# EAGLE schematic uStar_v1 (EAGLE 7.5.0)
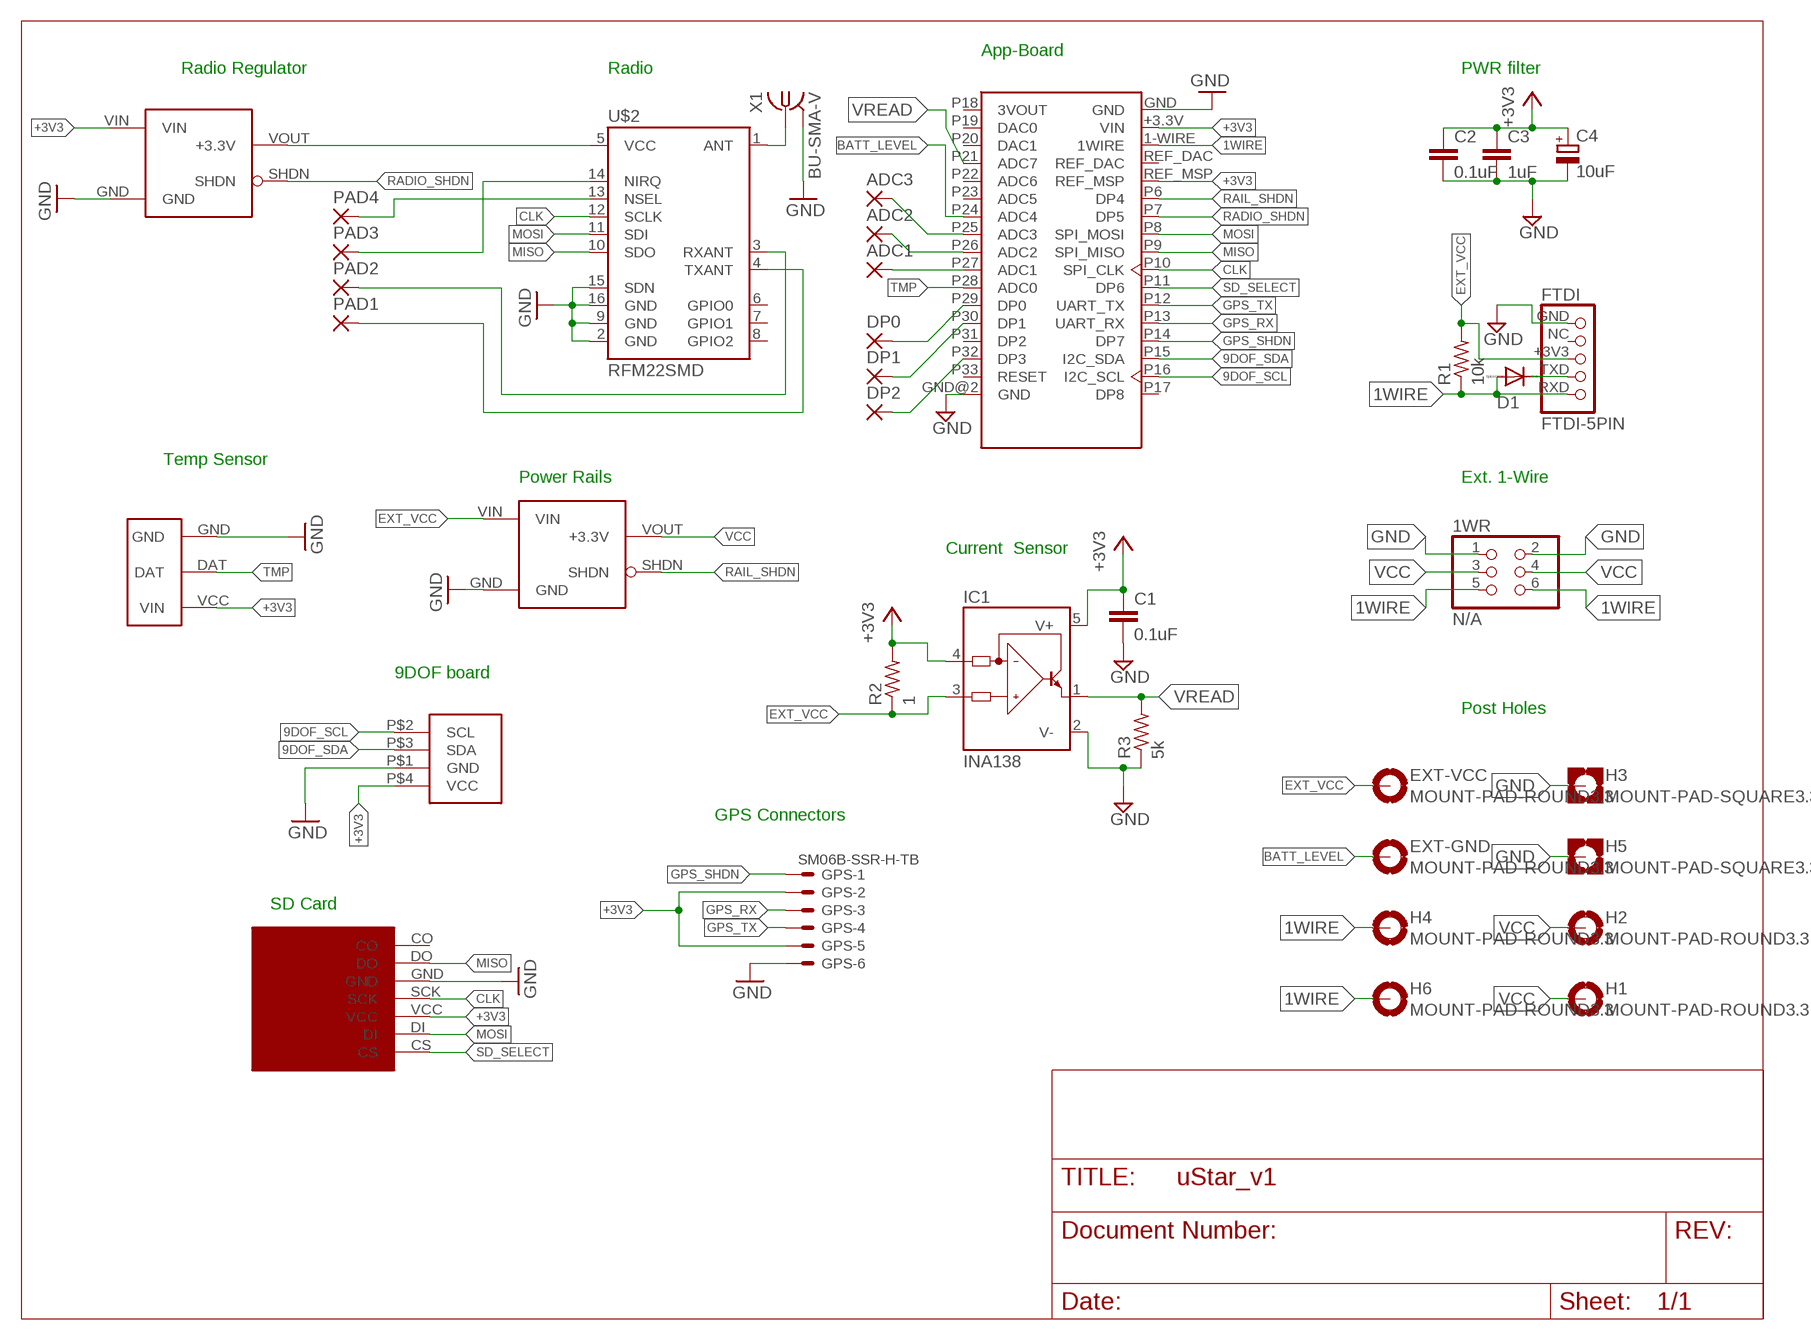
[diagram p0: schematic, sheet 1]

## Parts
1WR  N/A  PINHD-2X3  [2X03]
ADC1  1,6/0,9  [1,6/0,9]
ADC2  1,6/0,9  [1,6/0,9]
ADC3  1,6/0,9  [1,6/0,9]
C1  0.1uF  C-EUC0805  [C0805]
C2  0.1uF  C-EUC0603  [C0603]
C3  1uF  C-EUC0603  [C0603]
C4  10uF  CPOL-EUSMCB  [SMC_B]
D1  1N4148DO35-7  [DO35-7]
DP0  1,6/0,9  [1,6/0,9]
DP1  1,6/0,9  [1,6/0,9]
DP2  1,6/0,9  [1,6/0,9]
EXT-GND  MOUNT-PAD-ROUND3.3  [3,3-PAD]
EXT-VCC  MOUNT-PAD-ROUND3.3  [3,3-PAD]
FTDI  FTDI-5PIN  [1_05X2MM]
GPS  SM06B-SSR-H-TB  [SM06B-SSR-H-TB]
H1  MOUNT-PAD-ROUND3.3  [3,3-PAD]
H2  MOUNT-PAD-ROUND3.3  [3,3-PAD]
H3  MOUNT-PAD-SQUARE3.3  [3,3-PAD-SQUARE]
H4  MOUNT-PAD-ROUND3.3  [3,3-PAD]
H5  MOUNT-PAD-SQUARE3.3  [3,3-PAD-SQUARE]
H6  MOUNT-PAD-ROUND3.3  [3,3-PAD]
IC1  INA138  [SOT23-5]
PAD1  1,6/0,9  [1,6/0,9]
PAD2  1,6/0,9  [1,6/0,9]
PAD3  1,6/0,9  [1,6/0,9]
PAD4  1,6/0,9  [1,6/0,9]
R1  10k  R-US_0207/7  [0207/7]
R2  1  R-US_R0603  [R0603]
R3  5k  R-US_R0603  [R0603]
U$1  App-Board 1.2/1.3  APP_CORE  [APPCORE_RECEIVER]
U$2  RFM22SMD  [RFM22-XXX-S2]
U$3  S7V8F3_VOLT_REG-3V3_1AHORZ-DOWN  [S7V_DOWN]
U$4  TMP_EXT  [TMP_EXT]
U$5  9DOF  [9DOF]
U$6  BOB-00544  [BOB-00544]
U$7  S7V8F3_VOLT_REG-3V3_1AHORZ-DOWN  [S7V_DOWN]
X1  BU-SMA-V  [BU-SMA-V]

## Nets
1WIRE: 1WR.5 1WR.6 D1.A FTDI.RXD H4.B3,3(MOUNT) H6.B3,3(MOUNT) R1.1 U$1.1-WIRE(1WIRE)
9DOF_SCL: U$1.P16(I2C_SCL) U$5.P$2(SCL)
9DOF_SDA: U$1.P15(I2C_SDA) U$5.P$3(SDA)
+3V3: C1.1 C2.1 C3.1 C4.+ GPS.2 GPS.5 IC1.4(IN-) IC1.5(V+) R2.2 U$1.+3.3V(VIN) U$1.REF_MSP U$3.VIN U$4.VCC(VIN) U$5.P$4(VCC) U$6.VCC
BATT_LEVEL: EXT-GND.B3,3(MOUNT) U$1.P24(ADC4)
CLK: U$1.P10(SPI_CLK) U$2.12(SCLK) U$6.SCK
EXT_VCC: EXT-VCC.B3,3(MOUNT) FTDI.+3V3 IC1.3(IN+) R1.2 R2.1 U$7.VIN
GND: 1WR.1 1WR.2 C1.2 C2.2 C3.2 C4.- FTDI.GND GPS.6 H3.B3,3(MOUNT) H5.B3,3(MOUNT) IC1.2(V-) R3.1 U$1.GND U$1.GND@2(GND) U$2.2(GND) U$2.9(GND) U$2.15(SDN) U$2.16(GND) U$3.GND U$4.GND U$5.P$1(GND) U$6.GND U$7.GND X1.2 X1.3 X1.4 X1.5
GPS_RX: GPS.3 U$1.P13(UART_RX)
GPS_SHDN: GPS.1 U$1.P14(DP7)
GPS_TX: GPS.4 U$1.P12(UART_TX)
MISO: U$1.P9(SPI_MISO) U$2.10(SDO) U$6.DO
MOSI: U$1.P8(SPI_MOSI) U$2.11(SDI) U$6.DI
N$1: PAD1.1(P) U$2.4(TXANT)
N$2: PAD2.1(P) U$2.3(RXANT)
N$3: D1.C FTDI.TXD
N$4: PAD3.1(P) U$2.14(NIRQ)
N$5: PAD4.1(P) U$2.13(NSEL)
N$6: U$2.1(ANT) X1.1
N$7: U$2.5(VCC) U$3.VOUT(+3.3V)
N$8: ADC1.1(P) U$1.P27(ADC1)
N$9: ADC2.1(P) U$1.P26(ADC2)
N$10: ADC3.1(P) U$1.P25(ADC3)
N$11: DP0.1(P) U$1.P29(DP0)
N$12: DP1.1(P) U$1.P30(DP1)
N$13: DP2.1(P) U$1.P32(DP3)
RADIO_SHDN: U$1.P7(DP5) U$3.SHDN
RAIL_SHDN: U$1.P6(DP4) U$7.SHDN
SD_SELECT: U$1.P11(DP6) U$6.CS
TMP: U$1.P28(ADC0) U$4.DAT
VCC: 1WR.3 1WR.4 H1.B3,3(MOUNT) H2.B3,3(MOUNT) U$7.VOUT(+3.3V)
VREAD: IC1.1(OUT) R3.2 U$1.P21(ADC7)
Unconnected: FTDI.NC U$1.P17(DP8) U$1.P18(3VOUT) U$1.P19(DAC0) U$1.P20(DAC1) U$1.P22(ADC6) U$1.P23(ADC5) U$1.P31(DP2) U$1.P33(RESET) U$1.REF_DAC U$2.6(GPIO0) U$2.7(GPIO1) U$2.8(GPIO2) U$6.CO

## Notes on the sheet
- App-Board
- Radio Regulator | Radio | PWR filter
- Temp Sensor
- Power Rails | Ext. 1-Wire
- Current  Sensor
- 9DOF board
- Post Holes
- GPS Connectors
- SD Card

## Library data of the parts
1WR = pinhead:PINHD-2X3: PIN HEADER
ADC1-ADC3 DP0 DP1 DP2 PAD1-PAD4 = wirepad:1,6/0,9: THROUGH-HOLE PAD
C1-C3 = resistor:C-EU: CAPACITOR, European symbol
C4 = resistor:CPOL-EU: POLARIZED CAPACITOR, European symbol
D1 = diode:1N4148: DIODE high speed (Philips)
EXT-GND EXT-VCC H1 H2 H4 H6 = holes:MOUNT-PAD-ROUND: MOUNTING PAD, round
FTDI = FTDI:FTDI-5PIN
GPS = con-jst2:SM06B-SSR-H-TB: Disconnectable Insulation displacement connector, 1.0mm pitch 6 contacts
H3 H5 = holes:MOUNT-PAD-SQUARE: MOUNTING PAD, square
IC1 = burr-brown:INA138: High-Side Measurement Current Shunt Monitor; MF: TEXAS INSTRUMENTS; MPN: INA138NA/250; OC_FARNELL: 1564888; OC_NEWARK: 80K5906
R1-R3 = resistor:R-US_: RESISTOR, American symbol
U$1 = LearningByMaking2:APP_CORE
U$2 = SparkFun-RF:RFM22: The RFM22 is a low-power, low cost radio that is capable of operating in the 434MHz and 900MHz open bands. It's frequency is software defined and there are some very good libraries written for it.
U$3 U$7 = Pololu:S7V8F3_VOLT_REG-3V3_1A
U$4 = LearningByMaking:TMP_EXT
U$5 = LearningByMaking:9DOF
U$6 = LearningByMaking:BOB-00544
X1 = con-coax:BU-SMA-V: FEMALE SMA CONNECTOR Radiall distributor RS 112-3794; OC_FARNELL: unknown; OC_NEWARK: unknown